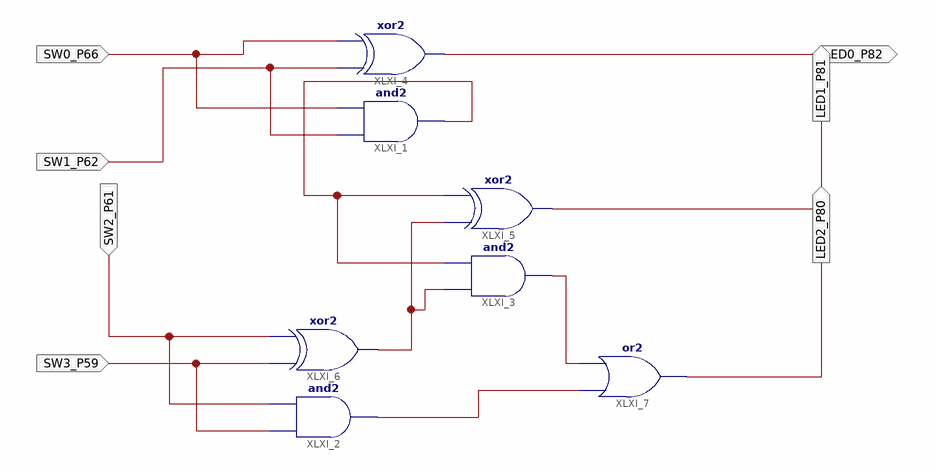
[diagram p0: schematic sheet 1]
// Xilinx ISE schematic lab4.sch (spartan6) as structural Verilog: 7 symbols, 7 ports
module lab4 (
  input  SW1_P62,
  input  SW0_P66,
  input  SW2_P61,
  input  SW3_P59,
  output LED0_P82,
  output LED1_P81,
  output LED2_P80
);

  wire XLXN_7, XLXN_13, XLXN_14, XLXN_15;

  and XLXI_1 (XLXN_7, SW1_P62, SW0_P66);
  xor XLXI_4 (LED0_P82, SW1_P62, SW0_P66);
  or XLXI_7 (LED2_P80, XLXN_15, XLXN_14);
  and XLXI_2 (XLXN_15, SW3_P59, SW2_P61);
  xor XLXI_6 (XLXN_13, SW3_P59, SW2_P61);
  and XLXI_3 (XLXN_14, XLXN_13, XLXN_7);
  xor XLXI_5 (LED1_P81, XLXN_13, XLXN_7);
endmodule
